# Altium schematic sheet 20dB_Attenuator_TX.SchDoc
size A4; SheetNumber: 20; SheetTotal: 26
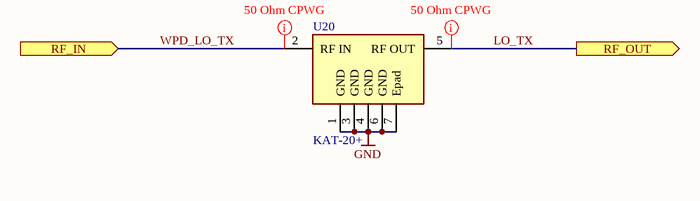
[diagram p0: 20dB_Attenuator_TX.SchDoc]

## Parts
U20  KAT-20+  [MC1630-1]

## Ports
RF_IN (in, see Top_Level[5B]), RF_OUT (out, see Top_Level[6B])

## Nets
GND: U20.1(GND) U20.3(GND) U20.4(GND) U20.6(GND) U20.7(Epad)
LO_TX: U20.5(RF_OUT) ; port RF_OUT
WPD_LO_TX: U20.2(RF_IN) ; port RF_IN

## Layout directives
net class 50Ohm_CPWG: LO_TX, WPD_LO_TX

## Library data of the parts
U20 = RF000016: Manufacturer: Minicircuits; ID: RF000016; Type: Attenuator; Manufacturer Part Number: KAT-20+; Part Value: KAT-20+; Case: MC1630-1; ComponentLink1Description: Datasheet; ComponentLink1URL: https://www.minicircuits.com/pdfs/KAT-20+.pdf; Supplier 1: Mouser; Supplier Part Number 1: 139-KAT-20+; Supplier 2: Digikey; Supplier Part Number 2: 3157-KAT-20+CT-ND